# EAGLE design Un_Zigbee_V1.0 (EAGLE 7.5.0)
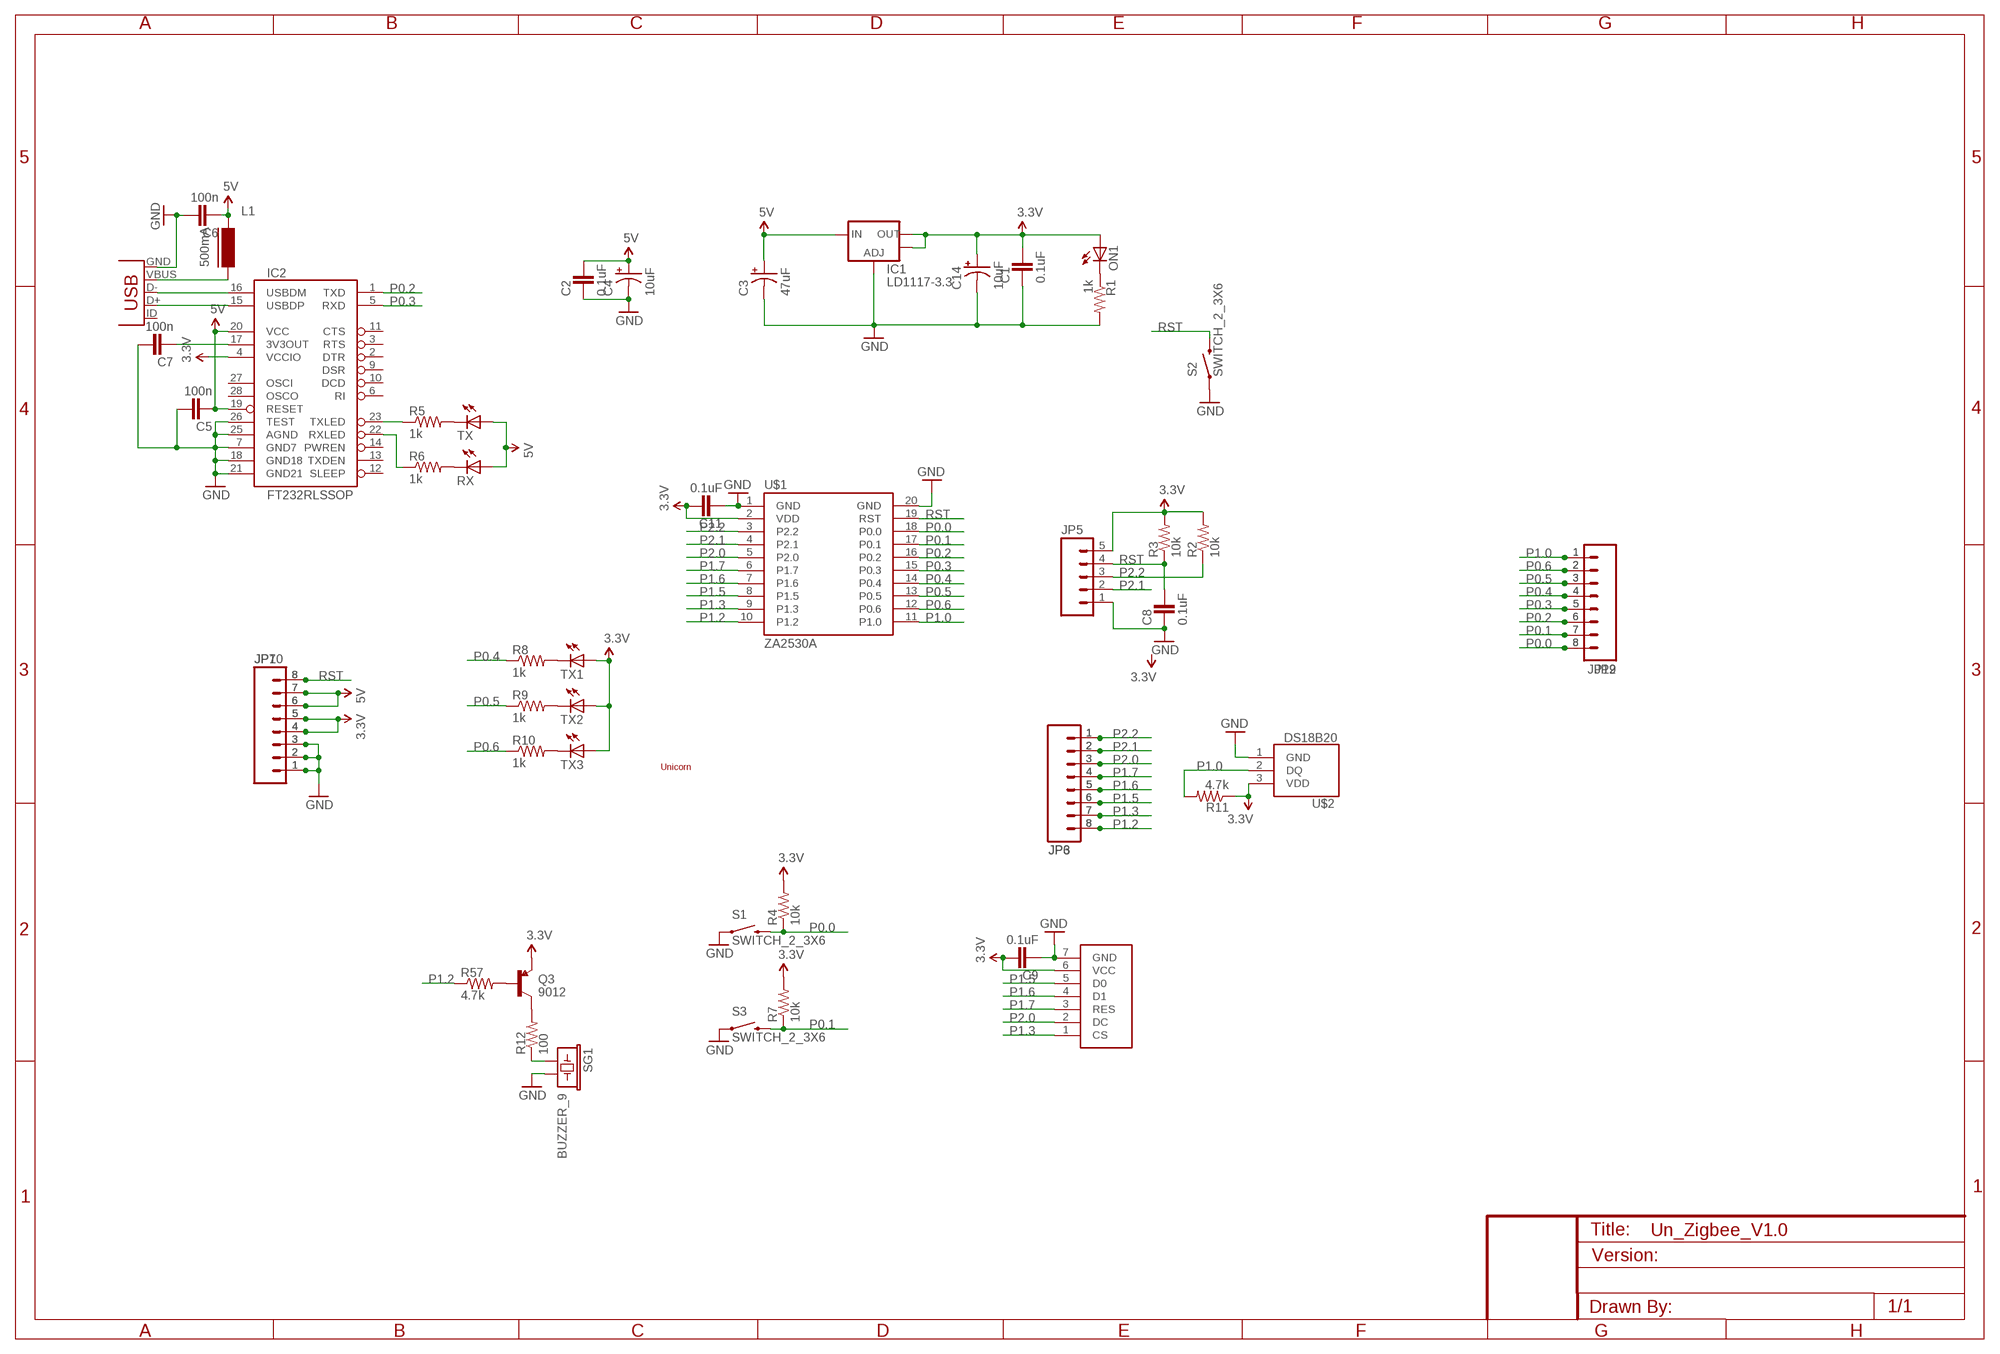
[diagram p0: schematic, sheet 1]

## Parts
C1  0.1uF  CAP0603  [0603-CAP]
C2  0.1uF  CAP0603  [0603-CAP]
C3  47uF  CAP_POL1206  [EIA3216]
C4  10uF  CAP_POL1206  [EIA3216]
C5  100n  CAP0603  [0603-CAP]
C6  100n  CAP0603  [0603-CAP]
C7  100n  CAP0603  [0603-CAP]
C8  0.1uF  CAP0603  [0603-CAP]
C9  0.1uF  CAP0603  [0603-CAP]
C11  0.1uF  CAP0603  [0603-CAP]
C14  10uF  CAP_POL1206  [EIA3216]
IC1  LD1117-3.3  V_REG_LM1117SOT223  [SOT223]
IC2  FT232RLSSOP  [SSOP28DB]
JP3  M08  [1X08]
JP5  M05PTH  [1X05]
JP6  M08  [1X08]
JP7  M08  [1X08]
JP9  M08  [1X08]
JP10  M08  [1X08]
JP12  M08  [1X08]
L1  500mA  FERRITE-0805  [FB805]
ON1  LED0603  [LED-0603]
Q3  9012  TRANSISTOR_PNPSMD  [SOT23-3]
R1  1k  RESISTOR0603-RES  [0603-RES]
R2  10k  RESISTOR0603-RES  [0603-RES]
R3  10k  RESISTOR0603-RES  [0603-RES]
R4  10k  RESISTOR0603-RES  [0603-RES]
R5  1k  RESISTOR0603-RES  [0603-RES]
R6  1k  RESISTOR0603-RES  [0603-RES]
R7  10k  RESISTOR0603-RES  [0603-RES]
R8  1k  RESISTOR0603-RES  [0603-RES]
R9  1k  RESISTOR0603-RES  [0603-RES]
R10  1k  RESISTOR0603-RES  [0603-RES]
R11  4.7k  RESISTOR0603-RES  [0603-RES]
R12  100  RESISTOR0603-RES  [0603-RES]
R57  4.7k  RESISTOR0603-RES  [0603-RES]
RX  LED0603  [LED-0603]
S1  SWITCH_2_3X6  [TACTILE-SWITCH-1101NE]
S2  SWITCH_2_3X6  [TACTILE-SWITCH-1101NE]
S3  SWITCH_2_3X6  [TACTILE-SWITCH-1101NE]
SG1  BUZZER_9  [BUZZER-9MM]
TX  LED0603  [LED-0603]
TX1  LED0603  [LED-0603]
TX2  LED0603  [LED-0603]
TX3  LED0603  [LED-0603]
U$1  ZA2530A  [ZA2530A]
U$2  DS18B20  [TO-92]
U$3  UNICORN_1  [UNICORN_1]
U$7  OLED_2  [OLED_2]
U$10  USB_5-SMD  [USB-MINIB]

## Nets
3.3V: C1.1 C9.1 C11.1 C14.A(+) IC1.2(OUT) IC1.4(OUT) IC2.4(VCCIO) JP5.5 JP7.4 JP7.5 JP10.4 JP10.5 ON1.A Q3.2(E) R2.2 R3.2 R4.2 R7.2 R11.1 TX1.A TX2.A TX3.A U$1.2(VDD) U$2.3(VDD) U$7.6(VCC)
5V [usbvcc]: C2.1 C3.A(+) C4.A(+) C5.2 C6.2 IC1.3(IN) IC2.19(RESET) IC2.20(VCC) JP7.6 JP7.7 JP10.6 JP10.7 L1.1 RX.A TX.A
GND [gnd]: C1.2 C2.2 C3.C(-) C4.C(-) C5.1 C6.1 C7.1 C8.2 C9.2 C11.2 C14.C(-) IC1.1(ADJ) IC2.7(GND7) IC2.18(GND18) IC2.21(GND21) IC2.25(AGND) IC2.26(TEST) JP5.1 JP7.1 JP7.2 JP7.3 JP10.1 JP10.2 JP10.3 R1.2 S1.P$1 S2.P$1 S3.P$1 SG1.- U$1.1(GND) U$1.20(GND) U$2.1(GND) U$7.7(GND) U$10.GND
N$1: ON1.C R1.1
N$2: Q3.3(C) R12.2
N$3: L1.2 U$10.VBUS
N$4: R8.2 TX1.C
N$5: IC2.16(USBDM) U$10.D-
N$6: IC2.15(USBDP) U$10.D+
N$7: IC2.23(TXLED) R5.1
N$8: R5.2 TX.C
N$9: R6.2 RX.C
N$10: IC2.22(RXLED) R6.1
N$20: R9.2 TX2.C
N$21: R10.2 TX3.C
N$22: C7.2 IC2.17(3V3OUT)
N$87: Q3.1(B) R57.2
N$118: R12.1 SG1.+
P0.0: JP9.8 JP12.8 R4.1 S1.P$2 U$1.18(P0.0)
P0.1: JP9.7 JP12.7 R7.1 S3.P$2 U$1.17(P0.1)
P0.2: IC2.1(TXD) JP9.6 JP12.6 U$1.16(P0.2)
P0.3: IC2.5(RXD) JP9.5 JP12.5 U$1.15(P0.3)
P0.4: JP9.4 JP12.4 R8.1 U$1.14(P0.4)
P0.5: JP9.3 JP12.3 R9.1 U$1.13(P0.5)
P0.6: JP9.2 JP12.2 R10.1 U$1.12(P0.6)
P1.0: JP9.1 JP12.1 R11.2 U$1.11(P1.0) U$2.2(DQ)
P1.2: JP3.8 JP6.8 R57.1 U$1.10(P1.2)
P1.3: JP3.7 JP6.7 U$1.9(P1.3) U$7.1(CS)
P1.5: JP3.6 JP6.6 U$1.8(P1.5) U$7.5(D0)
P1.6: JP3.5 JP6.5 U$1.7(P1.6) U$7.4(D1)
P1.7: JP3.4 JP6.4 U$1.6(P1.7) U$7.3(RES)
P2.0: JP3.3 JP6.3 U$1.5(P2.0) U$7.2(DC)
P2.1: JP3.2 JP5.2 JP6.2 U$1.4(P2.1)
P2.2: JP3.1 JP5.3 JP6.1 R2.1 U$1.3(P2.2)
RST: C8.1 JP5.4 JP7.8 JP10.8 R3.1 S2.P$2 U$1.19(RST)
Unconnected: IC2.2(DTR) IC2.3(RTS) IC2.6(RI) IC2.9(DSR) IC2.10(DCD) IC2.11(CTS) IC2.12(SLEEP) IC2.13(TXDEN) IC2.14(PWREN) IC2.27(OSCI) IC2.28(OSCO) U$10.ID(USBID)

## Library data of the parts
C1 C2 C5-C9 C11 = 2SparkFun:CAP: Capacitor Standard 0603 ceramic capacitor, and 0.1" leaded capacitor.
C3 C4 C14 = 2SparkFun:CAP_POL: Capacitor Polarized These are standard SMD and PTH capacitors. Normally 10uF, 47uF, and 100uF in electrolytic and tantalum varieties. Always verify the external diameter of the through hole cap, it varies with capacity, voltage, and manufacturer. The EIA devices should be standard.
IC1 = 1SparkFun:V_REG_LM1117: Voltage Regulator LM1117 Standard adjustable voltage regulator but in SMD form. Spark Fun Electronics SKU : COM-00595
IC2 = 1SparkFun:FT232RL: USB UART FT232RL 4th Generation USB UART (USB <-> Serial) Controller. Spark Fun Electronics SKU : COM-00650
JP3 JP6 JP7 JP9 JP10 JP12 = 1SparkFun:M08: Header 8 Standard 8-pin 0.1" header. Use with straight break away headers (SKU : PRT-00116), right angle break away headers (PRT-00553), swiss pins (PRT-00743), machine pins (PRT-00117), and female headers (PRT-00115).
JP5 = 2SparkFun:M05: Header 5 Standard 5-pin 0.1" header. Use with straight break away headers (SKU : PRT-00116), right angle break away headers (PRT-00553), swiss pins (PRT-00743), machine pins (PRT-00117), and female headers (PRT-00115). Molex polarized connector foot print use with SKU : PRT-08230 with associated crimp pins and housings.
L1 = 2SparkFun:FERRITE: Ferrite bead in various packages
ON1 RX TX TX1-TX3 = 1SparkFun:LED: LEDs Standard schematic elements and footprints for 5mm, 3mm, 1206, and 0603 sized LEDs. 5mm - Spark Fun Electronics SKU : COM-00529 (and others)
Q3 = 2SparkFun:TRANSISTOR_PNP
R1-R12 R57 = 2SparkFun:RESISTOR: Resistor Basic schematic elements and footprints for 0603, 1206, and PTH resistors.
S1-S3 = 2SparkFun:SWITCH_2
SG1 = 2SparkFun:BUZZER: Buzzer 12mm Spark Fun Electronics SKU : Comp-Buzzer
U$1 = 2SparkFun:ZA2530A
U$2 = 2SparkFun:DS18B20
U$3 = 2SparkFun:UNICORN
U$7 = 2SparkFun:OLED
U$10 = 2SparkFun:USB_5

## Net classes
0 default: width 0.254 mm, clearance 0.254 mm
1 power: width 0.61 mm, drill 0.61 mm, clearance 0.254 mm
2 gnd: width 0.305 mm, drill 0.381 mm, clearance 0.254 mm
3 usbvcc: width 0.508 mm, drill 0.61 mm, clearance 0.254 mm
4 aref: width 0.406 mm, drill 0.61 mm, clearance 0.254 mm

## Board
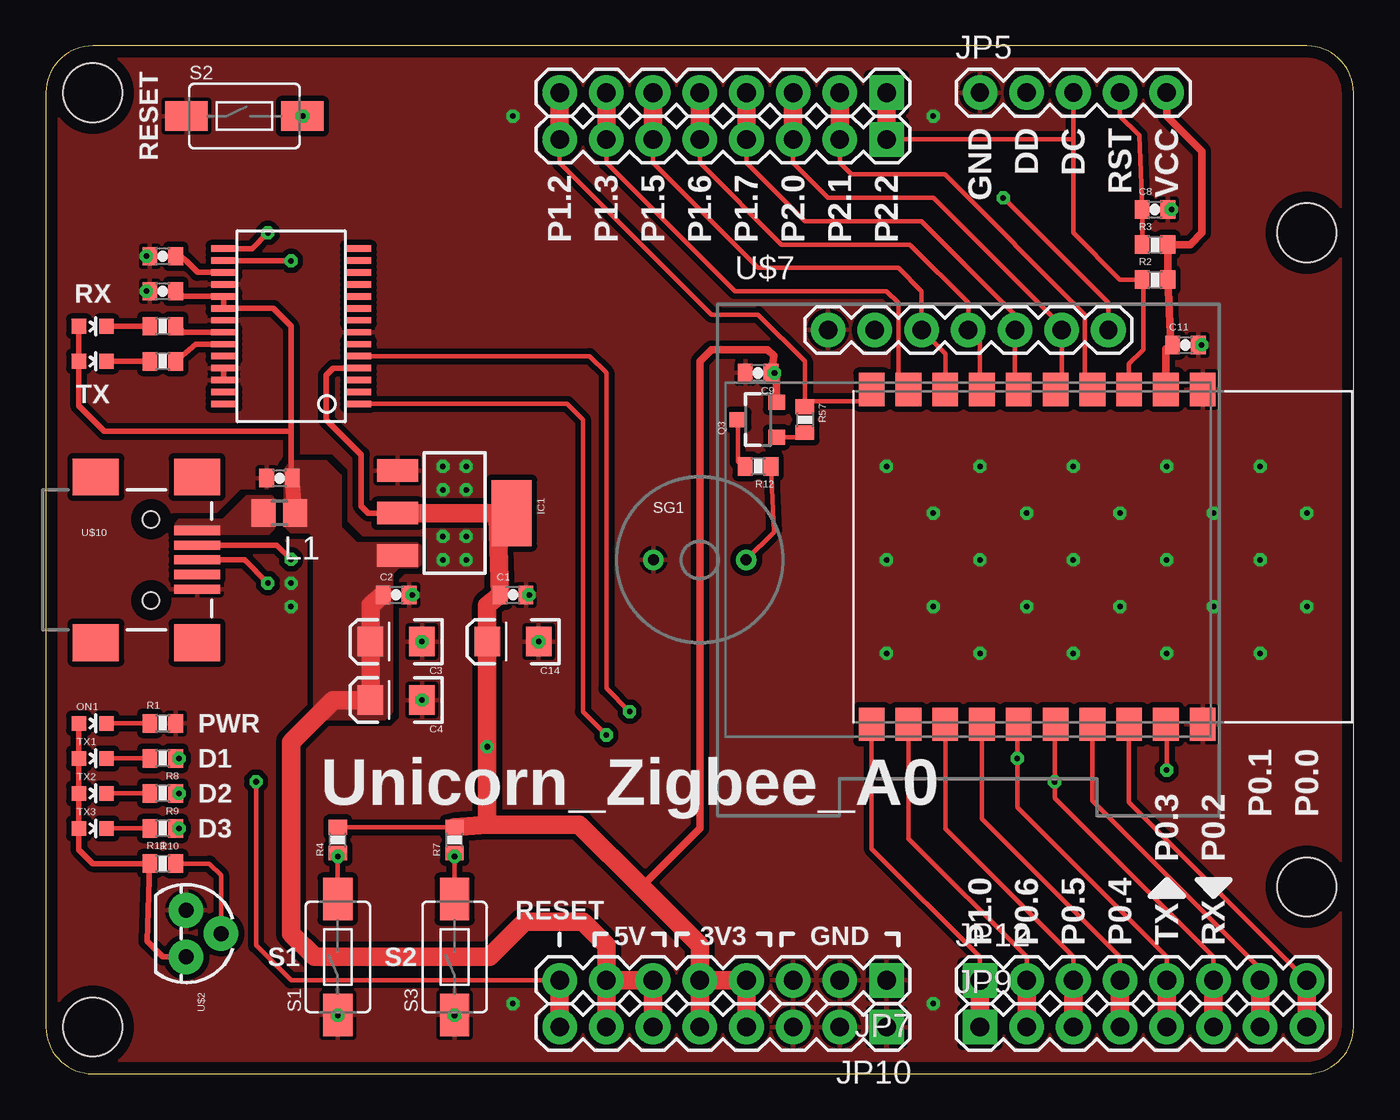
[diagram p1: board, top side]
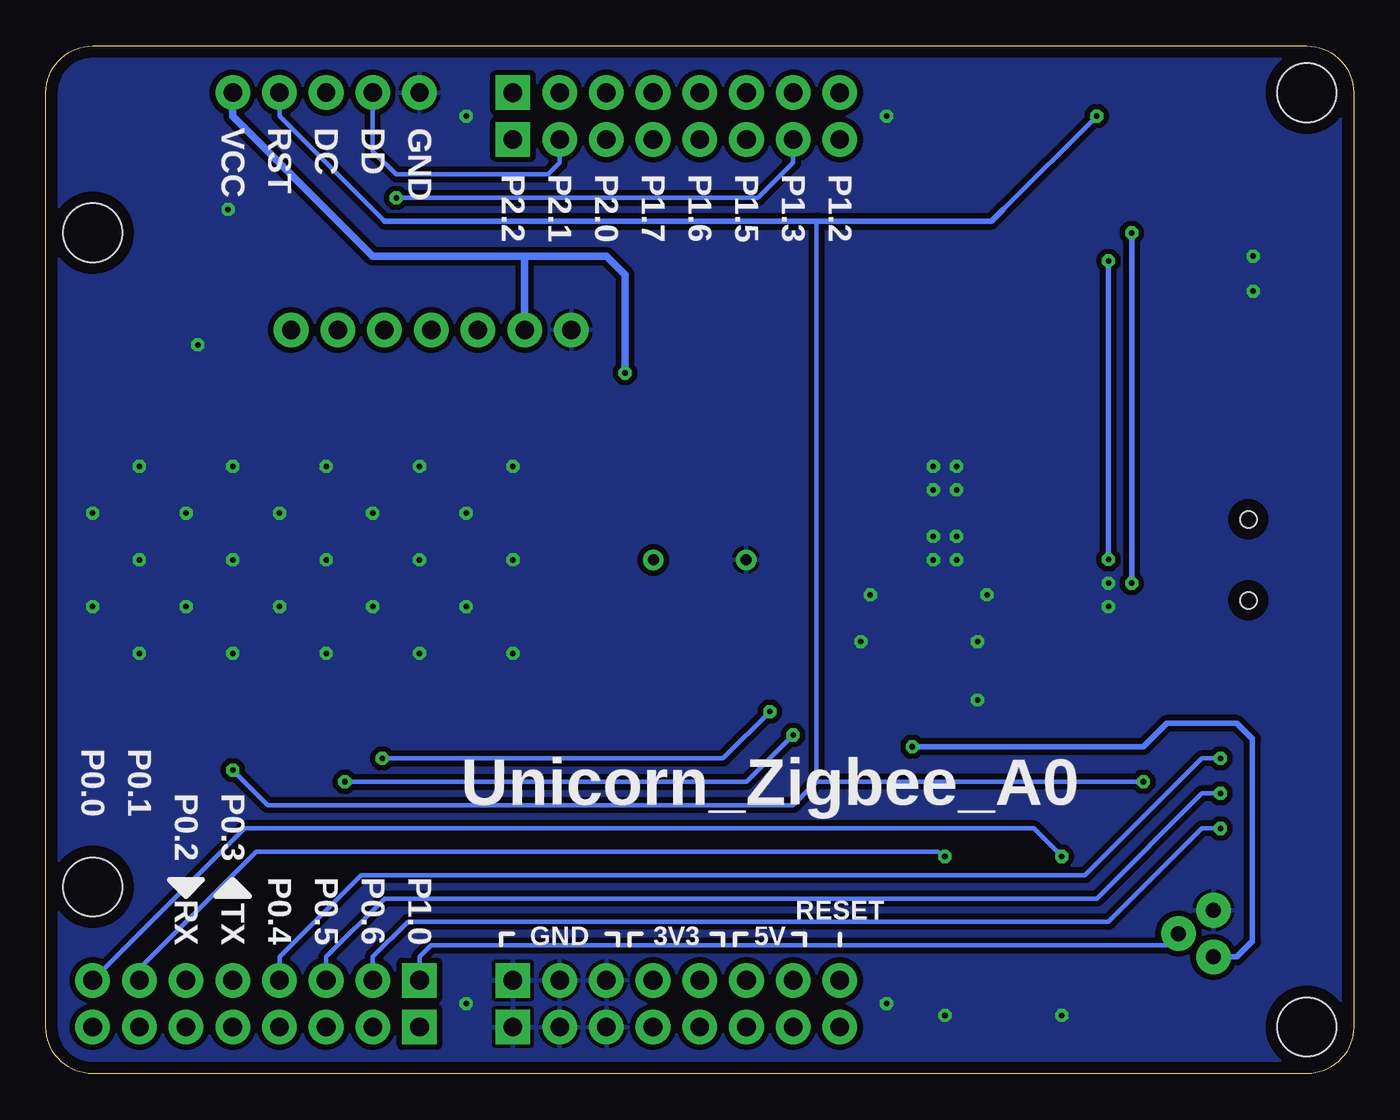
[diagram p2: board, bottom side, seen from below]

Size 71.12 x 55.88 mm. Coordinates in mm from the lower left corner, seen from the top.
Copper layers (1*16): Top 0.035mm / dielectric 1.5mm / Bottom 0.035mm
Design rules "yun": minimum track width 8mil, minimum drill 15mil, track to track 8mil, track to pad 8mil, pad to pad 8mil, via to via 8mil, smd to smd 8mil, copper to edge 25mil, drill to drill 8mil, minimum pad ring 10mil, minimum via ring 8mil, stop-mask expansion 4mil, vias tented up to drill 20mil, thermal gap 8mil

### Footprints (pad centres in the part's own frame; a part is rotated, then mirrored left to right if it is on the bottom)
0603-CAP = smd 0.8 x 1: 1 -0.7,0; 2 0.7,0
EIA3216 = smd 1.4 x 1.6: A 1.4,0; C -1.4,0
SOT223 = smd 1.219 x 2.235: 1 -2.311,-3.099; 2 0,-3.099; 3 2.311,-3.099 | smd 3.6 x 2.2: 4 0,3.099
SSOP28DB = smd 0.348 x 1.397: 1 -4.225,-3.656; 2 -3.575,-3.656; 3 -2.925,-3.656; 4 -2.275,-3.656; 5 -1.625,-3.656; 6 -0.975,-3.656; 7 -0.325,-3.656; 8 0.325,-3.656; 9 0.975,-3.656; 10 1.625,-3.656; 11 2.275,-3.656; 12 2.925,-3.656; 13 3.575,-3.656; 14 4.225,-3.656; 15 4.225,3.656; 16 3.575,3.656; 17 2.925,3.656; 18 2.275,3.656; 19 1.625,3.656; 20 0.975,3.656; 21 0.325,3.656; 22 -0.325,3.656; 23 -0.975,3.656; 24 -1.625,3.656; 25 -2.275,3.656; 26 -2.925,3.656; 27 -3.575,3.656; 28 -4.225,3.656
1X08 = drill 1.016 pad 1.88 square: 1 0,0 | drill 1.016 pad 1.88: 2 2.54,0; 3 5.08,0; 4 7.62,0; 5 10.16,0; 6 12.7,0; 7 15.24,0; 8 17.78,0
1X05 = drill 1 pad 1.88: 1 0,0; 2 2.54,0; 3 5.08,0; 4 7.62,0; 5 10.16,0
FB805 = smd 1.3 x 1.5: 1 -0.85,0; 2 0.85,0
LED-0603 = smd 0.8 x 0.8: A 0,-0.75; C 0,0.75
SOT23-3 = smd 0.8 x 0.9: 1 -0.95,-1; 2 0.95,-1; 3 0,1.1
0603-RES = smd 0.8 x 1: 1 -0.7,0; 2 0.7,0
TACTILE-SWITCH-1101NE = smd 2.3 x 1.6: P$1 -3.15,0; P$2 3.15,0
BUZZER-9MM = drill 0.6: + 2.52,0; - -2.52,0
ZA2530A = smd 1.8 x 1.4: 1 -9.26,5.76; 2 -9.26,3.76; 3 -9.26,1.76; 4 -9.26,-0.24; 5 -9.26,-2.24; 6 -9.26,-4.24; 7 -9.26,-6.24; 8 -9.26,-8.24; 9 -9.26,-10.24; 10 -9.26,-12.24; 11 8.94,-12.24; 12 8.94,-10.24; 13 8.94,-8.24; 14 8.94,-6.24; 15 8.94,-4.24; 16 8.94,-2.24; 17 8.94,-0.24; 18 8.94,1.76; 19 8.94,3.76; 20 8.94,5.76
TO-92 = drill 0.813 pad 1.88: 1 -1.27,0; 2 0,1.905; 3 1.27,0
UNICORN_1 = hole 3.2: -33.02,-25.4; 33.02,17.78; 33.02,-17.78; -33.02,25.4
OLED_2 = drill 1 pad 1.88: 1 7.62,12.5; 2 5.08,12.5; 3 2.54,12.5; 4 0,12.5; 5 -2.54,12.5; 6 -5.08,12.5; 7 -7.62,12.5
USB-MINIB = smd 2.5 x 0.5: D+ 2.5,0; D- 2.5,0.8; GND 2.5,-1.6; ID 2.5,-0.8; VBUS 2.5,1.6 | smd 2.5 x 2: MTN1 -3,4.5; MTN2 2.5,4.5; MTN3 -3,-4.5; MTN4 2.5,-4.5 | hole 0.9: 0,2.2; 0,-2.2

### Placement (x,y rotation side)
C1  25.4,26.04 0 top
C2  19.05,26.04 0 top
C3  19.05,23.5 180 top
C4  19.05,20.32 180 top
C5  6.35,42.55 0 top
C6  12.7,32.38 0 top
C7  6.35,44.45 0 top
C8  60.33,46.99 0 top
C9  38.73,38.1 180 top
C11  61.98,39.62 0 top
C14  25.4,23.5 180 top
IC1  22.23,30.48 270 top
IC2  13.34,40.64 90 top
JP3  45.72,53.34 180 top
JP5  50.8,53.34 0 top
JP6  45.72,50.8 180 top
JP7  45.72,5.08 180 top
JP9  50.8,2.54 0 top
JP10  45.72,2.54 180 top
JP12  50.8,5.08 0 top
L1  12.7,30.48 180 top
ON1  2.54,19.05 270 top
Q3  38.73,35.56 90 top
R1  6.35,19.05 0 top
R2  60.33,43.18 0 top
R3  60.33,45.09 0 top
R4  15.88,12.7 90 top
R5  6.35,38.73 180 top
R6  6.35,40.64 180 top
R7  22.23,12.7 90 top
R8  6.35,17.14 180 top
R9  6.35,15.24 180 top
R10  6.35,13.34 180 top
R11  6.35,11.43 0 top
R12  38.73,33.02 180 top
R57  41.27,35.56 270 top
RX  2.54,40.64 270 top
S1  15.88,6.35 90 top
S2  10.79,52.07 0 top
S3  22.23,6.35 90 top
SG1  35.56,27.94 0 top
TX  2.54,38.73 270 top
TX1  2.54,17.14 270 top
TX2  2.54,15.24 270 top
TX3  2.54,13.34 270 top
U$1  57.15,27.94 270 top
U$2  7.62,7.62 270 top
U$3  35.56,27.94 0 top
U$7  50.16,27.94 0 top
U$10  5.71,27.94 0 top

### Tracks (layer width: path | path; a pad name or v marks a point on that pad's centre or on a via)
3.3V  (via drill 0.3)
  Top 0.254: 60.91,39.41 C11.1 61.17,39.67 | R4.2 R7.2
  Top 0.305: IC1.2 17.53,30.48 17.14,30.86 17.14,33.66 15.24,35.56 15.24,37.97 15.63,38.37 IC2.4 | v24,17.78 24,17.14 | U$2.3 6.35,6.35 5.5,7.2 R11.1 2.54,11.43 1.79,12.18 TX3.A TX2.A TX1.A ON1.A
  Top 0.406: U$1.2 60.91,39.41 | 61.17,39.67 R2.2 R3.2 62.23,45.09 62.87,45.72 62.87,50.16 60.96,52.07 JP5.5 | 32.38,10.16 35.56,13.34 35.56,38.73 36.2,39.37 39.24,39.37 39.59,39.03 C9.1 | Q3.2 39.73,37.95 C9.1 | C9.1 v39.62,38.1
  Top 1.016: JP7.5 JP7.4 JP10.4 | JP10.5 JP7.5 | IC1.4 24.77,30.48 | 24.77,30.48 IC1.2 | JP7.5 35.56,6.99 32.38,10.16 29,13.55 24,13.55 | 24,13.55 R7.2 | 24,13.55 24,17.14 C14.A 24,25.48 C1.1 24.55,30.27 24.77,30.48
  Bottom 0.305: U$2.3 6.35,6.35 5.5,7.2 5.5,18.2 6.35,19.05 10.16,19.05 11.43,17.78 v24,17.78
  Bottom 0.406: JP5.5 60.96,52.07 53.34,44.45 45.09,44.45 | v39.62,38.1 39.62,43.43 40.64,44.45 45.09,44.45 | U$7.6 45.09,44.45
5V
  Top 0.305: 13.34,34.92 13.34,40.64 12.36,41.62 IC2.20 IC2.19 7.48,42.27 C5.2 | 13.34,34.92 13.34,32.6 C6.2 | 13.34,34.92 3.17,34.92 1.79,36.31 TX.A RX.A
  Top 0.813: L1.1 C6.2
  Top 1.016: JP10.6 JP7.6 JP7.7 | JP10.7 JP7.7 | JP7.7 30.48,6.99 29.21,8.26 26.04,8.26 24.13,6.35 14.61,6.35 13.34,7.62 13.34,18.03 15.62,20.32 C4.A C3.A 17.65,25.48 C2.1
  pour Top (isolate 0.305, no thermals): 13.34,33.27 13,32.84 13,29.79 13.34,29.46 14.35,29.46 14.61,29.21 14.61,19.81 15.11,19.3 18.41,19.3 18.8,19.68 18.8,27.18 19.18,27.56 20.19,27.56 20.32,27.69 20.32,28.7 20.19,28.83 16.89,28.83 16,29.72 16,32.51 15.24,33.27
GND  (via drill 0.3)
  Top 0.305: IC2.25 IC2.26
  other vias: 21.59,31.75 22.86,31.75 21.59,29.21 22.86,29.21 5.46,42.55 21.59,33.02 22.86,33.02 21.59,27.94 22.86,27.94 48.26,3.81 13.34,25.4 13.34,26.67 5.46,44.45 20.45,23.5 20.45,20.32 19.94,26.04 26.8,23.5 26.29,26.04 22.23,3.17 15.88,3.17 62.87,39.62 61.21,46.99 45.72,27.94 48.26,30.48 45.72,33.02 50.8,33.02 50.8,27.94 48.26,25.4 45.72,22.86 50.8,22.86 53.34,25.4 53.34,30.48 55.88,27.94 55.88,33.02 55.88,22.86 58.42,25.4 58.42,30.48 60.96,33.02 60.96,27.94 60.96,22.86 63.5,25.4 63.5,30.48 66.04,33.02 66.04,22.86 66.04,27.94 68.58,30.48 68.58,25.4 48.26,52.07 25.4,52.07 25.4,3.81
  pour Bottom (isolate 0.305, rank 2): 0,0 71.12,0 71.12,55.88 0,55.88
  pour Top (isolate 0.305, rank 2): 0,0 71.12,0 71.12,55.88 0,55.88
N$1
  Top 0.254: ON1.C R1.1
N$2
  Top 0.254: R12.2 37.63,33.27 Q3.3
N$3
  pour Top (isolate 0.305, no thermals): 7.09,29.39 12.12,29.39 12.37,29.64 12.4,31.24 12.27,31.37 10.92,31.37 9.65,30.1 7.24,30.1 7.09,29.9
N$4
  Top 0.254: TX1.C R8.2
N$5  (via drill 0.3)
  Top 0.305: IC2.16 13.32,44.22 v13.34,44.2 | U$10.D- 12.56,28.74 v13.34,27.96
  Bottom 0.305: v13.34,27.96 v13.34,44.2
N$6  (via drill 0.3)
  Top 0.305: U$10.D+ 10.79,27.94 v12.06,26.67 | IC2.15 11.21,44.87 v12.06,45.72
  Bottom 0.305: v12.06,26.67 v12.06,45.72
N$7
  Top 0.305: IC2.23 8.13,39.66 R5.1
N$8
  Top 0.305: TX.C R5.2
N$9
  Top 0.305: RX.C R6.2
N$10
  Top 0.305: IC2.22 7.53,40.31 R6.1
N$20
  Top 0.254: TX2.C R9.2
N$21
  Top 0.254: TX3.C R10.2
N$22
  Top 0.305: IC2.17 8.25,43.56 7.81,44.01 7.62,44.2 7.37,44.45 C7.2
N$87
  Top 0.254: Q3.1 41.17,34.61 R57.2
N$118
  Top 0.254: R12.1 39.59,29.45 SG1.+
P0.0  (via drill 0.3)
  Top 0.254: U$1.18 58.91,14.75 JP12.8 | R4.1 v15.88,11.81 S1.P$2
  Top 1.016: JP9.8 JP12.8
  Bottom 0.254: JP12.8 60.33,13.34 17.4,13.34 v15.88,11.81
P0.1  (via drill 0.3)
  Top 0.254: U$1.17 56.91,14.85 66.04,5.71 JP12.7 | R7.1 v22.23,11.81 S3.P$2
  Top 1.016: JP9.7 JP12.7
  Bottom 0.254: JP12.7 66.04,5.71 59.69,12.06 22.61,12.06 v22.23,11.81
P0.2  (via drill 0.3)
  Top 0.254: JP12.6 63.5,6.35 54.86,14.99 v54.86,15.88 54.86,18.95 U$1.16 | IC2.1 28.36,36.41 29.21,35.56 29.21,19.68 v30.48,18.41
  Top 1.016: JP9.6 JP12.6
  Bottom 0.254: v54.86,15.88 33.02,15.88 v30.48,18.41
P0.3  (via drill 0.3)
  Top 0.254: JP12.5 60.96,6.35 52.83,14.48 v52.83,17.14 52.83,18.92 U$1.15 | IC2.5 29.57,39.02 30.48,38.1 30.48,20.95 v31.75,19.68
  Top 1.016: JP9.5 JP12.5
  Bottom 0.254: v52.83,17.14 34.29,17.14 v31.75,19.68
P0.4  (via drill 0.3)
  Top 0.254: U$1.14 50.91,13.86 58.42,6.35 JP12.4 | R8.1 v7.24,17.14
  Top 1.016: JP9.4 JP12.4
  Bottom 0.254: JP12.4 58.42,6.35 53.98,10.79 14.61,10.79 8.26,17.14 v7.24,17.14
P0.5  (via drill 0.3)
  Top 0.254: U$1.13 48.91,13.32 55.88,6.35 JP12.3 | R9.1 v7.24,15.24
  Top 1.016: JP9.3 JP12.3
  Bottom 0.254: JP12.3 55.88,6.35 52.7,9.53 13.97,9.53 8.26,15.24 v7.24,15.24
P0.6  (via drill 0.3)
  Top 0.254: JP12.2 53.34,6.35 46.91,12.78 U$1.12 | R10.1 v7.24,13.34
  Top 1.016: JP9.2 JP12.2
  Bottom 0.254: JP12.2 53.34,6.35 51.44,8.26 13.34,8.26 8.26,13.34 v7.24,13.34
P1.0
  Top 0.254: U$1.11 44.91,12.24 50.8,6.35 JP12.1 | R11.2 8.89,11.43 9.53,10.79 U$2.2
  Top 1.016: JP9.1 JP12.1
  Bottom 0.254: JP12.1 50.8,6.35 50.16,6.99 10.16,6.99 U$2.2
P1.2
  Top 0.254: JP6.8 27.94,49.53 36.2,41.27 38.73,41.27 41.27,38.73 R57.1 41.44,36.58 44.29,36.58 U$1.10
  Top 1.016: JP3.8 JP6.8
P1.3  (via drill 0.3)
  Top 0.254: 46.99,37.28 U$1.9 46.35,37.76 46.35,41.91 45.72,42.55 37.47,42.55 30.48,49.53 JP6.7 | U$7.1 57.78,41.91 v52.07,47.62
  Top 1.016: JP3.7 JP6.7
  Bottom 0.254: JP6.7 30.48,49.53 32.38,47.62 v52.07,47.62
P1.5
  Top 0.254: U$1.8 48.91,39.16 U$7.5 47.62,42.55 46.35,43.81 38.73,43.81 33.02,49.53 JP6.6
  Top 1.016: JP3.6 JP6.6
P1.6
  Top 0.254: U$1.7 50.8,37.31 50.8,39.8 U$7.4 50.16,41.91 46.99,45.09 40.01,45.09 35.56,49.53 JP6.5
  Top 1.016: JP3.5 JP6.5
P1.7
  Top 0.254: U$1.6 52.7,37.41 U$7.3 52.7,41.27 47.62,46.35 41.27,46.35 38.1,49.53 JP6.4
  Top 1.016: JP3.4 JP6.4
P2.0
  Top 0.254: U$1.5 55.24,37.53 U$7.2 55.24,40.64 48.26,47.62 42.55,47.62 40.64,49.53 JP6.3
  Top 1.016: JP3.3 JP6.3
P2.1
  Top 0.254: U$1.4 56.52,37.59 56.52,41.27 48.9,48.9 43.81,48.9 43.18,49.53 JP6.2
  Top 1.016: JP3.2 JP6.2
  Bottom 0.254: JP5.2 53.34,50.16 52.07,48.9 43.81,48.9 43.18,49.53 JP6.2
P2.2
  Top 0.254: U$1.3 58.91,38.59 59.69,39.37 59.69,42.97 R2.1 58.42,43.18 55.88,45.72 55.88,50.8 | 55.88,50.8 JP6.1 | JP5.3 55.88,50.8
  Top 1.016: JP6.1 JP3.1
RST  (via drill 0.3)
  Top 0.254: U$1.19 60.96,18.95 v60.96,16.51 | JP7.8 13.34,5.08 11.43,6.99 v11.43,15.88 | S2.P$2 v13.97,52.07 | R3.1 C8.1 59.48,51.02 58.42,52.07 JP5.4
  Top 1.016: JP10.8 JP7.8
  Bottom 0.254: 29.21,15.88 30.48,14.61 59.05,14.61 v60.96,16.51 | v11.43,15.88 29.21,15.88 | 19.05,46.99 v13.97,52.07 | JP5.4 58.42,52.07 52.7,46.35 | 29.21,46.35 29.21,15.88
  Bottom 0.305: 52.7,46.35 29.21,46.35 19.68,46.35 19.05,46.99

### Text on the board
tPlace: RESET | GND | DD | DC | RST | VCC | P1.2 | P1.3 | P1.5 | P1.6 | P1.7 | P2.0 | P2.1 | P2.2 | RX | TX | PWR | D1 | Unicorn_Zigbee_A0 | D2 | P0.3 | P0.2 | P0.1 | P0.0 | D3 | RESET | 5V | 3V3 | GND | P1.0 | P0.6 | P0.5 | P0.4 | TX | RX | S1 | S2
bPlace: GND | DD | DC | RST | VCC | P1.2 | P1.3 | P1.5 | P1.6 | P1.7 | P2.0 | P2.1 | P2.2 | Unicorn_Zigbee_A0 | P0.3 | P0.2 | P0.1 | P0.0 | RESET | 5V | 3V3 | GND | P1.0 | P0.6 | P0.5 | P0.4 | TX | RX